# Altium schematic sheet top_PS_v3.SchDoc
size Letter; SheetNumber: 1; SheetTotal: 2
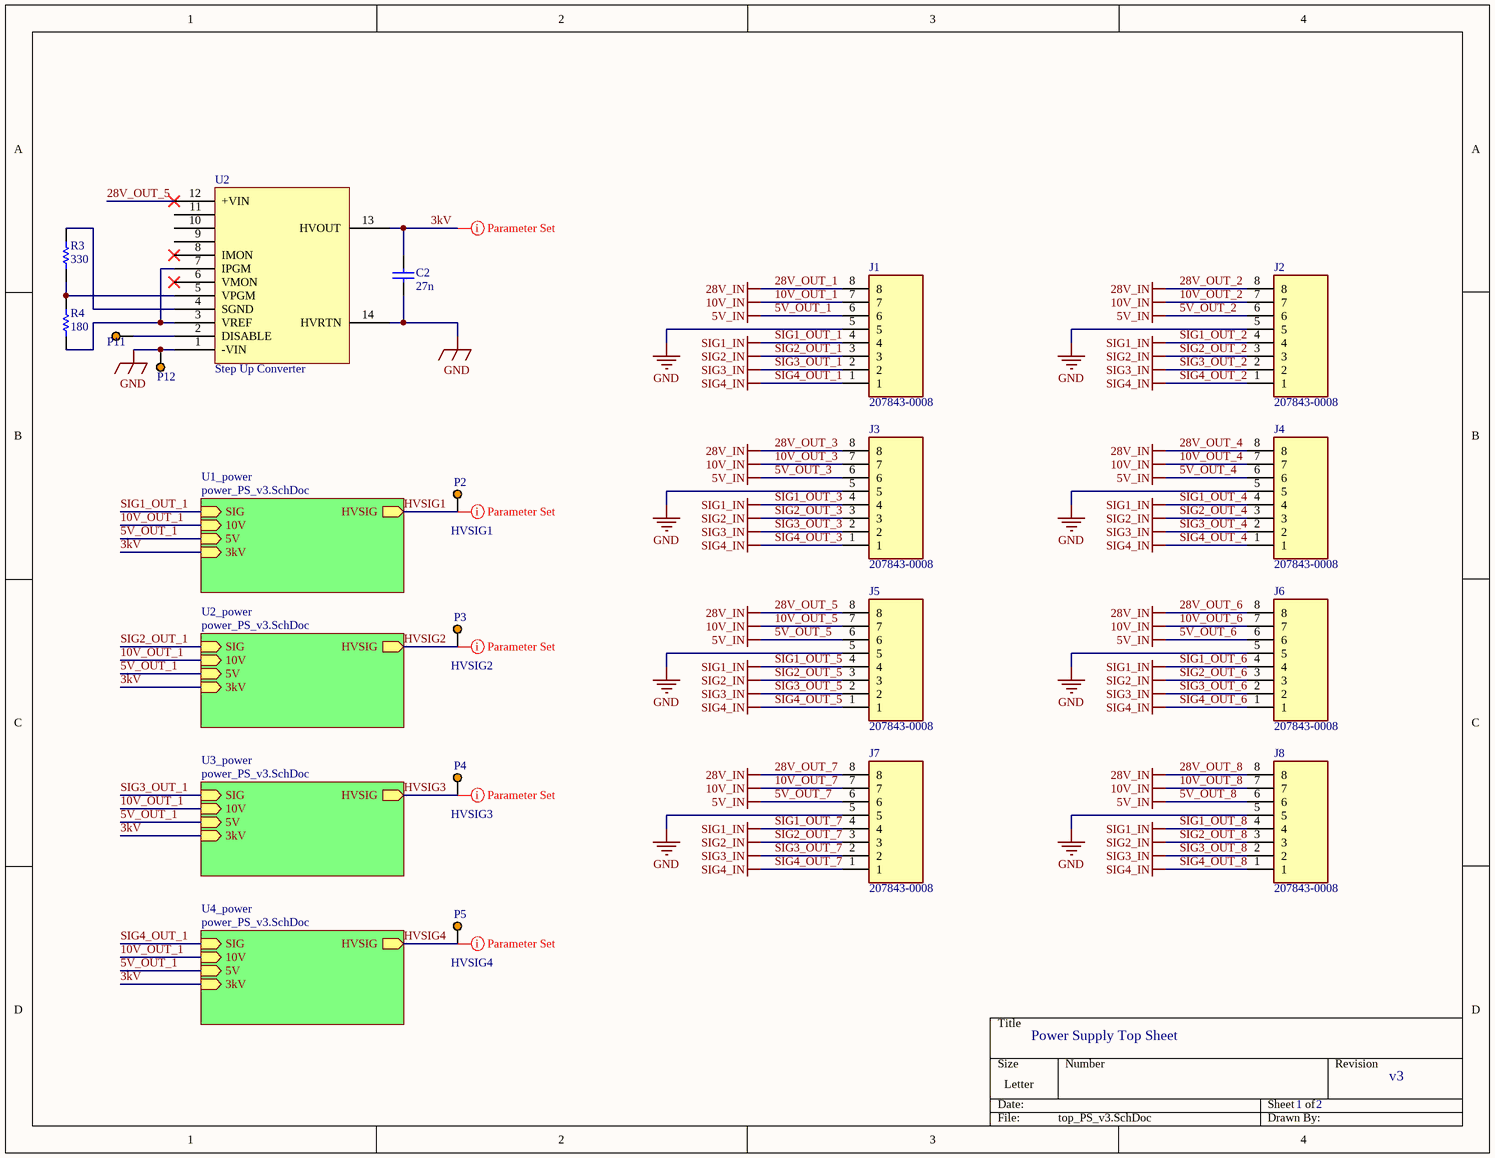
[diagram p0: top_PS_v3.SchDoc]

## Parts
C2  27n  [HV Capacitor]
J1  207843-0008  [1x8 Molex Header - Female]
J2  207843-0008  [1x8 Molex Header - Female]
J3  207843-0008  [1x8 Molex Header - Female]
J4  207843-0008  [1x8 Molex Header - Female]
J5  207843-0008  [1x8 Molex Header - Female]
J6  207843-0008  [1x8 Molex Header - Female]
J7  207843-0008  [1x8 Molex Header - Female]
J8  207843-0008  [1x8 Molex Header - Female]
P2  HVSIG1  [Via]
P3  HVSIG2  [Via]
P4  HVSIG3  [Via]
P5  HVSIG4  [Via]
P11  DISABLE  [Via]  (value not drawn)
P12  -VIN  [Via]  (value not drawn)
R3  330  [330 Ohm]
R4  180  [180 Ohm]
U2  Step Up Converter  [Step Up Converter]

## Sub-sheets
U1_power = power_PS_v3.SchDoc: SIG (in), 10V (in), 5V (in), HVSIG (out), 3kV (in)
U2_power = power_PS_v3.SchDoc: SIG (in), 10V (in), 5V (in), HVSIG (out), 3kV (in)
U3_power = power_PS_v3.SchDoc: SIG (in), 10V (in), 5V (in), HVSIG (out), 3kV (in)
U4_power = power_PS_v3.SchDoc: SIG (in), 10V (in), 5V (in), HVSIG (out), 3kV (in)

## Nets
5V_OUT_1: J1.6 J2.6 J3.6 J4.6 J5.6 J6.6 J7.6 J8.6 ; sheet U1_power/5V, sheet U2_power/5V, sheet U3_power/5V, sheet U4_power/5V  [also labelled 5V_IN, 5V_OUT_2, 5V_OUT_3, 5V_OUT_4, 5V_OUT_5, 5V_OUT_6, 5V_OUT_7, 5V_OUT_8]
10V_OUT_1: J1.7 J2.7 J3.7 J4.7 J5.7 J6.7 J7.7 J8.7 ; sheet U1_power/10V, sheet U2_power/10V, sheet U3_power/10V, sheet U4_power/10V  [also labelled 10V_IN, 10V_OUT_2, 10V_OUT_3, 10V_OUT_4, 10V_OUT_5, 10V_OUT_6, 10V_OUT_7, 10V_OUT_8]
28V_OUT_1: J1.8 J2.8 J3.8 J4.8 J5.8 J6.8 J7.8 J8.8 U2.12(+VIN)  [also labelled 28V_IN, 28V_OUT_2, 28V_OUT_3, 28V_OUT_4, 28V_OUT_5, 28V_OUT_6, 28V_OUT_7, 28V_OUT_8]
GND: C2.1 J1.5 J2.5 J3.5 J4.5 J5.5 J6.5 J7.5 J8.5 P12.1 U2.1(-VIN) U2.14(HVRTN)
SIG1_OUT_1: J1.4 J2.4 J3.4 J4.4 J5.4 J6.4 J7.4 J8.4 ; sheet U1_power/SIG  [also labelled SIG1_IN, SIG1_OUT_2, SIG1_OUT_3, SIG1_OUT_4, SIG1_OUT_5, SIG1_OUT_6, SIG1_OUT_7, SIG1_OUT_8]
SIG2_OUT_1: J1.3 J2.3 J3.3 J4.3 J5.3 J6.3 J7.3 J8.3 ; sheet U2_power/SIG  [also labelled SIG2_IN, SIG2_OUT_2, SIG2_OUT_3, SIG2_OUT_4, SIG2_OUT_5, SIG2_OUT_6, SIG2_OUT_7, SIG2_OUT_8]
SIG3_OUT_1: J1.2 J2.2 J3.2 J4.2 J5.2 J6.2 J7.2 J8.2 ; sheet U3_power/SIG  [also labelled SIG3_IN, SIG3_OUT_2, SIG3_OUT_3, SIG3_OUT_4, SIG3_OUT_5, SIG3_OUT_6, SIG3_OUT_7, SIG3_OUT_8]
SIG4_OUT_1: J1.1 J2.1 J3.1 J4.1 J5.1 J6.1 J7.1 J8.1 ; sheet U4_power/SIG  [also labelled SIG4_IN, SIG4_OUT_2, SIG4_OUT_3, SIG4_OUT_4, SIG4_OUT_5, SIG4_OUT_6, SIG4_OUT_7, SIG4_OUT_8]
3kV: C2.2 U2.13(HVOUT) ; sheet U1_power/3kV, sheet U2_power/3kV, sheet U3_power/3kV, sheet U4_power/3kV
HVSIG1: P2.1 ; sheet U1_power/HVSIG
HVSIG2: P3.1 ; sheet U2_power/HVSIG
HVSIG3: P4.1 ; sheet U3_power/HVSIG
HVSIG4: P5.1 ; sheet U4_power/HVSIG
NetP11_1: P11.1 U2.2(DISABLE)
NetR3_1: R3.1 U2.4(SGND)
NetR3_2: R3.2 R4.1 U2.5(VPGM)
NetR4_2: R4.2 U2.3(VREF) U2.7(IPGM)

Not connected (* = marked no-connect by the designer): U2 6(VMON)* 8(IMON)* 9 10 11

## Layout directives
rule Clearance Constraint [Generic clearance = 6.8mm, and 33 value(s) for objects]: 3kV, HVSIG1, HVSIG2, HVSIG3, HVSIG4

## Notes on the sheet
- Power Supply Top Sheet
- 1
- 2
- v3

## Library data of the parts
C2 = Capacitor
J1-J8 = 207843-0008: 1x8 Header; Manufacturer_Name: Molex; Datasheet Link: https://www.molex.com/pdm_docs/sd/2078430008_sd.pdf; Height: 6.95mm; Manufacturer_Part_Number: 207843-0008; Mouser Part Number: 538-207843-0008; Mouser Price/Stock: https://www.mouser.co.uk/ProductDetail/Molex/207843-0008?qs=XeJtXLiO41QJV3n1oae5pg%3D%3D
P2-P5 P11 P12 = Output Point: Thru hole via
R3 R4 = Resistor
U2 = Step Up Converter: HRL30